# EAGLE design particle-logo-v1 (EAGLE 7.5.0)
DATABASE: /home/monkbroc/Electronics/eagle/PARTSDB.tsv
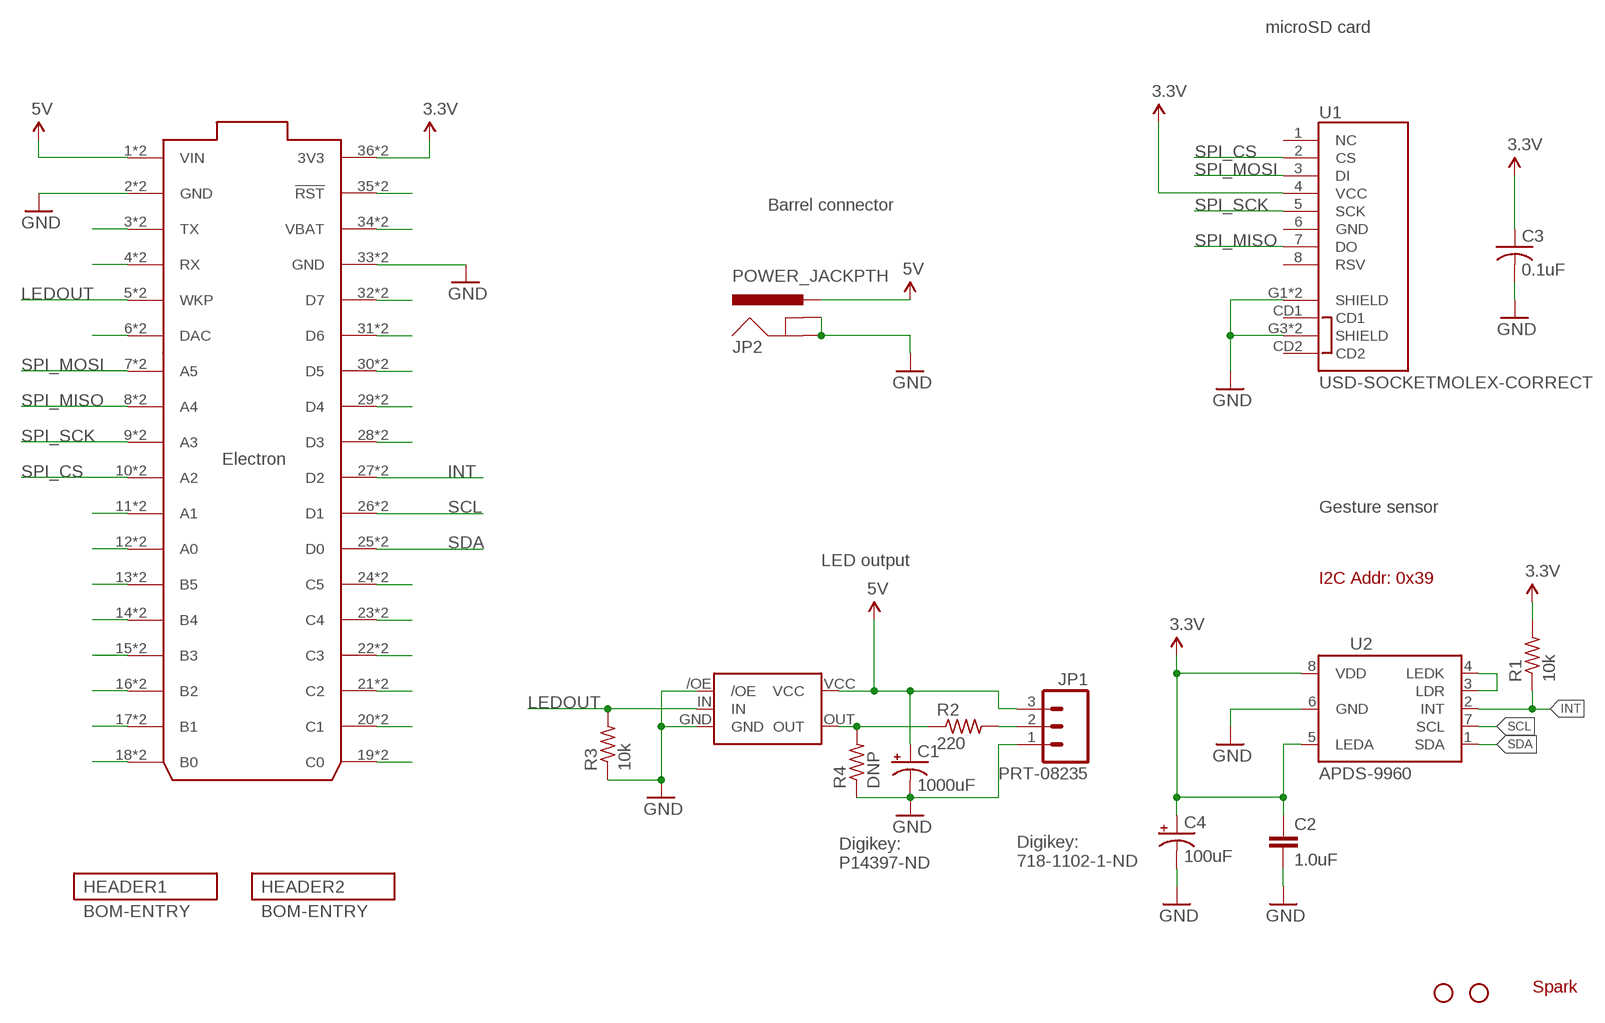
[diagram p0: schematic, sheet 1]
HEADER1 (BOM-ENTRY): PARTNO: PPTC181LFBN-RC
HEADER2 (BOM-ENTRY): PARTNO: PPTC181LFBN-RC

## Parts
C1  1000uF  CAP_POL8MMX20MM-FLAT-MIR  [CPOL-8MMX20MM-FLAT-MIR]
C2  1.0uF  1.0UF-16V-10%(0603)  [0603-CAP]
C3  0.1uF  C-USC0603  [C0603]
C4  100uF  100UF-10V-10%(TANT)  [EIA7343]
JP1  PRT-08235  M03SCREW  [SCREWTERMINAL-3.5MM-3]
JP2  POWER_JACKPTH  [POWER_JACK_PTH]
R1  10k  R-US_R0603  [R0603]
R2  220  R-US_R0603  [R0603]
R3  10k  R-US_R0603  [R0603]
R4  DNP  R-US_R0603  [R0603]
STANDOFF1  STAND-OFFSCREW-2  [STAND-OFF-2]
STANDOFF2  STAND-OFFSCREW-2  [STAND-OFF-2]
U1  USD-SOCKETMOLEX-CORRECT  [MICRO-SD-MOLEX-CORRECT]
U2  APDS-9960  [APDS-9960]
U3  ELECTRON_WITH_EXTERNAL_HEADERS_NT  [ELECTRON_EXTERNAL_NT]
U4  NL17SZ125SOT553  [SOT-553]
U$1  SPARK_LOGO2  [SPARK_LOGO2]

## Nets
3.3V: C2.1 C3.1 C4.A(+) R1.2 U1.4(VCC) U2.5(LEDA) U2.8(VDD) U3.36(3V3) U3.@36(3V3)
5V: C1.2(+) JP1.3 JP2.PWR U3.1(VIN) U3.@1(VIN) U4.VCC
GND: C1.1(-) C2.2 C3.2 C4.C(-) JP1.1 JP2.GND JP2.GNDBREAK R3.1 R4.1 U1.G1(SHIELD) U1.G2(SHIELD) U1.G3(SHIELD) U1.G4(SHIELD) U2.6(GND) U3.2(GND) U3.33(GND) U3.@2(GND) U3.@33(GND) U4./OE U4.GND
INT: R1.1 U2.2(INT) U3.27(D2) U3.@27(D2)
LEDOUT: R3.2 U3.5(WKP) U3.@5(WKP) U4.IN
N$1: R2.1 R4.2 U4.OUT
N$2: U2.3(LDR) U2.4(LEDK)
N$3: JP1.2 R2.2
N$4: U3.3(TX) U3.@3(TX)
N$5: U3.4(RX) U3.@4(RX)
N$7: U3.6(DAC) U3.@6(DAC)
N$8: U3.11(A1) U3.@11(A1)
N$9: U3.12(A0) U3.@12(A0)
N$10: U3.13(B5) U3.@13(B5)
N$11: U3.14(B4) U3.@14(B4)
N$12: U3.15(B3) U3.@15(B3)
N$13: U3.16(B2) U3.@16(B2)
N$14: U3.17(B1) U3.@17(B1)
N$15: U3.18(B0) U3.@18(B0)
N$16: U3.19(C0) U3.@19(C0)
N$17: U3.20(C1) U3.@20(C1)
N$18: U3.21(C2) U3.@21(C2)
N$19: U3.22(C3) U3.@22(C3)
N$20: U3.23(C4) U3.@23(C4)
N$21: U3.24(C5) U3.@24(C5)
N$22: U3.28(D3) U3.@28(D3)
N$24: U3.29(D4) U3.@29(D4)
N$25: U3.30(D5) U3.@30(D5)
N$26: U3.31(D6) U3.@31(D6)
N$27: U3.32(D7) U3.@32(D7)
N$29: U3.34(VBAT) U3.@34(VBAT)
N$30: U3.35(!RST) U3.@35(!RST)
SCL: U2.7(SCL) U3.26(D1) U3.@26(D1)
SDA: U2.1(SDA) U3.25(D0) U3.@25(D0)
SPI_CS: U1.2(CS) U3.10(A2) U3.@10(A2)
SPI_MISO: U1.7(DO) U3.8(A4) U3.@8(A4)
SPI_MOSI: U1.3(DI) U3.7(A5) U3.@7(A5)
SPI_SCK: U1.5(SCK) U3.9(A3) U3.@9(A3)
Unconnected: U1.1(NC) U1.6(GND) U1.8(RSV) U1.CD1 U1.CD2

## Notes on the sheet
- microSD card
- Barrel connector
- Gesture sensor
- LED output
- I2C Addr: 0x39
- Digikey:
  P14397-ND
- Digikey: 
  718-1102-1-ND

## Library data of the parts
C1 = MuniRent:CAP_POL: Capacitor Polarized These are standard SMD and PTH capacitors. Normally 10uF, 47uF, and 100uF in electrolytic and tantalum varieties. Always verify the external diameter of the through hole cap, it varies with capacity, voltage, and manufacturer. The EIA devices should be standard.; PARTNO: EEU-FR1C102L
C2 = SparkFun-Capacitors:1.0UF-16V-10%(0603): CAP-00868; PARTNO: 0603YD105KAT2A; PROD_ID: CAP-00868
C3 = rcl:C-US: CAPACITOR, American symbol; PARTNO: CC0603JRX7R7BB104
C4 = SparkFun-Capacitors:100UF-10V-10%(TANT): CAP-07890; PARTNO: TAJD107K020RNJ; PROD_ID: CAP-07890
JP1 = SparkFun-Connectors:M03: Header 3 Standard 3-pin 0.1" header. Use with straight break away headers (SKU : PRT-00116), right angle break away headers (PRT-00553), swiss pins (PRT-00743), machine pins (PRT-00117), and female headers (PRT-00115). Molex polarized connector foot print use with SKU : PRT-08232 with associated crimp pins and housings.; PROD_ID: CONN-08288
JP2 = SparkFun-Connectors:POWER_JACK: Power Jack This is the standard 5.5mm barrel jack for power. The PTH is the most common, proven, reliable, footprint. The Slot footprint only works if the mill layer is transmitted to the PCB fab house so be warned. Mating wall wart : TOL-00298 (and others); PROD_ID: CONN-08197
R1 R3 = rcl:R-US_: RESISTOR, American symbol; PARTNO: ERJ-3EKF1002V
R2 = rcl:R-US_: RESISTOR, American symbol; PARTNO: ERJ-3GEYJ221V
R4 = rcl:R-US_: RESISTOR, American symbol; DNP: t
STANDOFF1 STANDOFF2 = SparkFun-Electromechanical:STAND-OFF: #4 Stand Off This is the mechanical footprint for a #4 phillips button head screw. Use the keepout ring to avoid running the screw head into surrounding components. SKU : PRT-00447; BOM: exclude
U1 = MuniRent:USD-SOCKET: microSD Socket Push-push type uSD socket. Schematic element and footprint production proven. Spark Fun Electronics SKU : PRT-00127. tDoc lines correctly indicate media card edge positions when inserting (unlocked, locked, depressed). NOTE: CD1 and CD2 are connected internally; PARTNO: 1040310811
U2 = SparkFun-Sensors:APDS-9960: Avago APDS-9960 digital proximity, ambient light, RGB, and gesture sensor.; PARTNO: APDS-9960; PROD_ID: SEN-12005
U3 = MuniRent:ELECTRON
U4 = Spark:NL17SZ125; PARTNO: NL17SZ125DTT1G
U$1 = Spark:SPARK_LOGO2; BOM: exclude

## Board
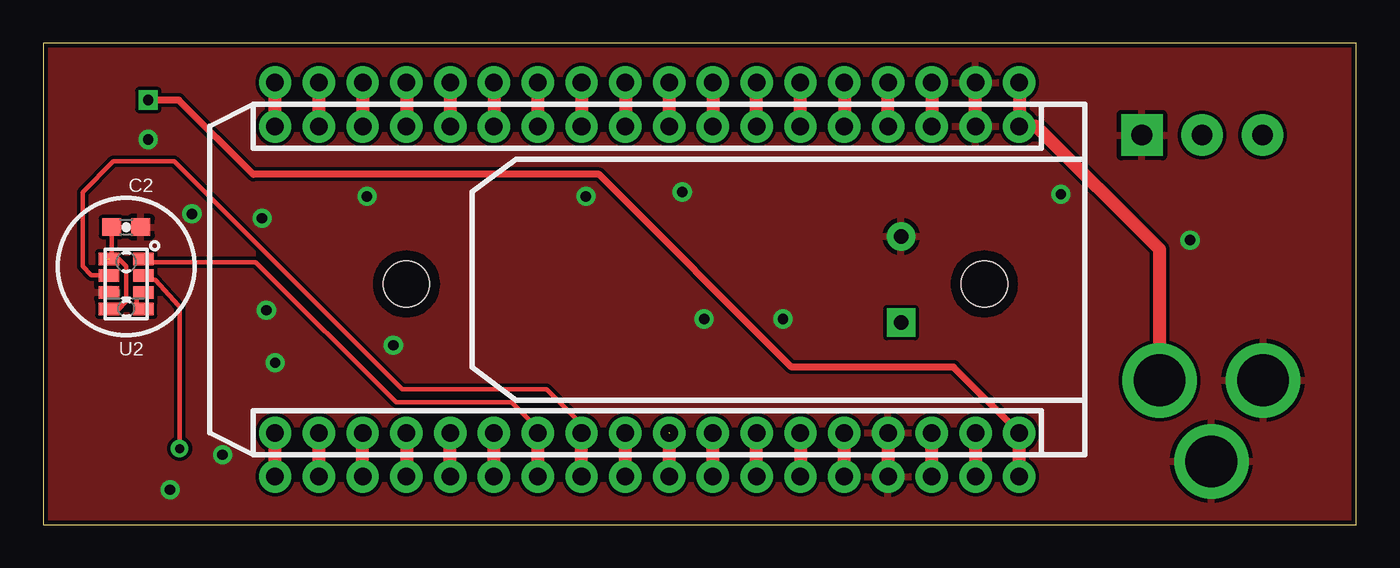
[diagram p1: board, top side]
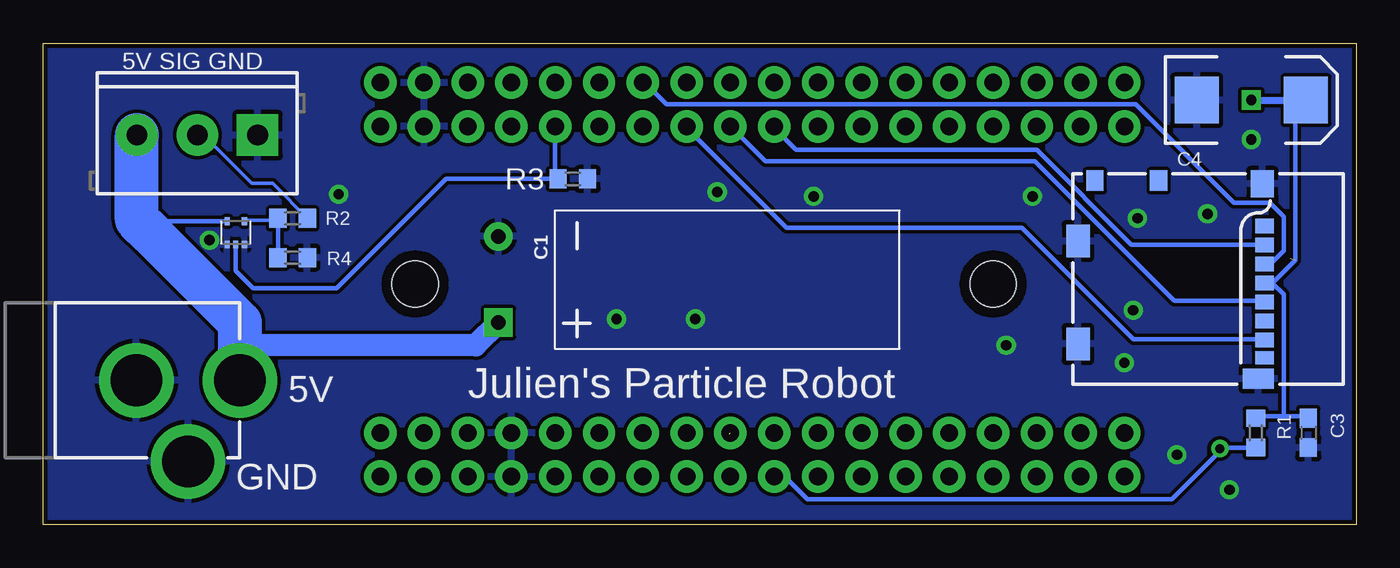
[diagram p2: board, bottom side, seen from below]

Size 76.2 x 27.94 mm. Coordinates in mm from the lower left corner, seen from the top.
Outline: 0,0 76.2,0 76.2,27.94 0,27.94 0,0
Copper layers (1*16): Top 0.035mm / dielectric 1.5mm / Bottom 0.035mm
Design rules "SparkFun": minimum track width 8mil, minimum drill 20mil, track to track 8mil, track to pad 8mil, pad to pad 8mil, via to via 8mil, smd to smd 8mil, copper to edge 10mil, drill to drill 8mil, minimum pad ring 12mil, minimum via ring 10mil, stop-mask expansion 4mil, vias tented up to drill 25mil, thermal gap 10mil

### Footprints (pad centres in the part's own frame; a part is rotated, then mirrored left to right if it is on the bottom)
CPOL-8MMX20MM-FLAT-MIR = drill 0.838 pad 1.651: 1 2.5,0 | drill 0.838 pad 1.651 square: 2 -2.5,0
0603-CAP = smd 1.1 x 1: 1 -0.85,0; 2 0.85,0
C0603 = smd 1.1 x 1: 1 -0.85,0; 2 0.85,0
EIA7343 = smd 2.55 x 2.7: A 3.17,0; C -3.17,0
SCREWTERMINAL-3.5MM-3 = drill 1.2 pad 2.413 square: 1 0,0 | drill 1.2 pad 2.413: 2 3.5,0; 3 7,0
POWER_JACK_PTH = drill 2.997 pad 4.318: GND 0,7.7; GNDBREAK 4.7,10.7; PWR 0,13.7
R0603 = smd 1 x 1.1: 1 -0.85,0; 2 0.85,0
STAND-OFF-2 = hole 2.667: 0,0
MICRO-SD-MOLEX-CORRECT = smd 0.85 x 1.1: 1 3.105,0.25; 2 2.005,0.25; 3 0.905,0.25; 4 -0.195,0.25; 5 -1.295,0.25; 6 -2.395,0.25; 7 -3.495,0.25 | smd 0.75 x 1.1: 8 -4.545,0.25 | smd 1.2 x 1: CD1 5.74,6.4; CD2 5.74,10.1 | smd 1.55 x 1.35: G1 5.565,0.375 | smd 1.17 x 1.8: G2 -5.755,0.6 | smd 1.9 x 1.35: G3 -3.735,11.075; G4 2.235,11.075
APDS-9960 = smd 1.2 x 0.72: 1 1,1.455; 2 1,0.485; 3 1,-0.485; 4 1,-1.455; 5 -1,-1.455; 6 -1,-0.485; 7 -1,0.485; 8 -1,1.455
ELECTRON_EXTERNAL_NT = drill 1.016 pad 1.88: 1 1.27,46.99; 2 1.27,44.45; 3 1.27,41.91; 4 1.27,39.37; 5 1.27,36.83; 6 1.27,34.29; 7 1.27,31.75; 8 1.27,29.21; 9 1.27,26.67; 10 1.27,24.13; 11 1.27,21.59; 12 1.27,19.05; 13 1.27,16.51; 14 1.27,13.97; 15 1.27,11.43; 16 1.27,8.89; 17 1.27,6.35; 18 1.27,3.81; 19 19.05,3.81; 20 19.05,6.35; 21 19.05,8.89; 22 19.05,11.43; 23 19.05,13.97; 24 19.05,16.51; 25 19.05,19.05; 26 19.05,21.59; 27 19.05,24.13; 28 19.05,26.67; 29 19.05,29.21; 30 19.05,31.75; 31 19.05,34.29; 32 19.05,36.83; 33 19.05,39.37; 34 19.05,41.91; 35 19.05,44.45; 36 19.05,46.99; @1 -1.27,46.99; @2 -1.27,44.45; @3 -1.27,41.91; @4 -1.27,39.37; @5 -1.27,36.83; @6 -1.27,34.29; @7 -1.27,31.75; @8 -1.27,29.21; @9 -1.27,26.67; @10 -1.27,24.13; @11 -1.27,21.59; @12 -1.27,19.05; @13 -1.27,16.51; @14 -1.27,13.97; @15 -1.27,11.43; @16 -1.27,8.89; @17 -1.27,6.35; @18 -1.27,3.81; @19 21.59,3.81; @20 21.59,6.35; @21 21.59,8.89; @22 21.59,11.43; @23 21.59,13.97; @24 21.59,16.51; @25 21.59,19.05; @26 21.59,21.59; @27 21.59,24.13; @28 21.59,26.67; @29 21.59,29.21; @30 21.59,31.75; @31 21.59,34.29; @32 21.59,36.83; @33 21.59,39.37; @34 21.59,41.91; @35 21.59,44.45; @36 21.59,46.99
SOT-553 = smd 0.3 x 0.45: /OE -0.5,0; GND 0.5,0; IN 0,0; OUT 0.5,1.35; VCC -0.5,1.35

### Placement (x,y rotation side)
C1  49.78,14.22 90 bottom
C2  4.83,17.27 0 top
C3  2.79,5.33 270 bottom
C4  6.1,24.64 0 bottom
JP1  63.75,22.61 180 bottom
JP2  78.49,8.38 270 bottom
R1  5.84,5.33 90 bottom
R2  61.72,17.78 0 bottom
R3  45.47,20.07 180 bottom
R4  61.72,15.49 180 bottom
STANDOFF1  54.61,13.97 0 bottom
STANDOFF2  21.08,13.97 0 bottom
U1  5.08,14.22 90 bottom
U2  4.83,13.97 0 top
U3  9.65,24.38 270 top
U4  65.02,16.26 0 bottom
U$1  55.37,7.11 0 bottom

### Tracks (layer width: path | path; a pad name or v marks a point on that pad's centre or on a via)
3.3V  (via drill 0.6)  (1 unrouted)
  Top 0.203: 4.01,12.65 U2.5 | 4.2,12.45 U2.5 | 4.06,17.27 C2.1 | 3.66,12.6 U2.5 | 6.1,24.59 v6.1,24.64
  Top 0.254: C2.1 3.98,15.57 U2.8 4.39,15.43 4.83,14.99 4.83,12.95 4.39,12.52 U2.5
  Top 0.406: U3.36 52.83,9.14 43.43,9.14 32.26,20.32 12.19,20.32 7.87,24.64 v6.1,24.64
  Top 0.762: U3.@36 U3.36
  Bottom 0.203: 2.85,6.3 C3.1 | 5.69,6.3 R1.2 | 3.56,24.59 C4.A | 4.88,14.02 5.28,14.02 U1.4 4.88,14.02
  Bottom 0.254: 5.69,6.3 4.22,6.3 | 4.22,6.3 2.85,6.3 | 4.22,6.3 4.22,13.36 4.88,14.02 3.56,15.34 3.56,24.59
  Bottom 0.406: v6.1,24.64 C4.A
5V
  Top 0.762: U3.@1 U3.1 57.64,23.11 64.79,15.97 JP2.PWR
  Bottom 0.203: 69.09,17.61 69.09,17.68 69.91,16.86
  Bottom 0.254: U4.VCC 69.09,17.61 70.58,17.61 | 64.77,11.43 64.77,11.72
  Bottom 1.27: C1.2 51.09,10.41 64.77,10.41 64.77,11.72
  Bottom 2.54: JP2.PWR 64.77,8.4 64.77,10.41 64.77,11.43 | 64.77,11.72 69.91,16.86 70.75,17.71 JP1.3
GND  (via drill 0.6)
  Top 0.762: U3.33 U3.@33 | U3.2 U3.@2
  Bottom 0.203: 48.97,3.05 U3.@33
  other vias: 18.8,19.05 37.08,19.3 59.05,19.18 38.35,11.94 10.41,4.06 8.64,18.03 66.55,16.51 31.5,19.05 42.93,11.94 12.95,12.45 7.37,2.03 13.46,9.4 12.7,17.78 20.32,10.41 6.1,22.35
  pour Bottom (rank 3): 0,27.94 76.2,27.94 76.2,0 0,0
  pour Top (rank 3): 76.2,27.94 0,27.94 0,0 76.2,0
INT  (via drill 0.51)
  Top 0.203: 5.84,14.28 5.64,14.28 U2.2 5.89,14.22
  Top 0.254: 5.89,14.22 6.5,14.22 7.87,12.7 7.92,12.65 v7.92,4.42
  Top 0.762: U3.@27 U3.27
  Bottom 0.203: 7.92,4.47 v7.92,4.42
  Bottom 0.254: U3.@27 33.68,2.69 33.07,2.69 31.85,1.47 10.72,1.47 7.92,4.27 v7.92,4.42 | 7.92,4.47 5.86,4.47 R1.1
LEDOUT
  Top 0.762: U3.@5 U3.5
  Bottom 0.254: U4.IN 65.02,14.73 64.01,13.72 59.18,13.72 52.83,20.07 R3.2 46.48,20.23 U3.5
N$1
  Bottom 0.203: U4.OUT 64.41,17.68 62.38,17.68 R2.1
  Bottom 0.254: R4.2 R2.1
N$2
  Top 0.203: 5.44,12.65 U2.4 | 5.44,13.46 U2.3
  Top 0.254: 5.44,13.46 5.44,12.65
N$3
  Bottom 0.203: R2.2 60.76,17.68 62.89,19.81 64.11,19.81 67.06,22.76 JP1.2
N$4
  Top 0.762: U3.@3 U3.3
N$5
  Top 0.762: U3.4 U3.@4
N$7
  Top 0.762: U3.6 U3.@6
N$8
  Top 0.762: U3.@11 U3.11
N$9
  Top 0.762: U3.@12 U3.12
N$10
  Top 0.762: U3.@13 U3.13
N$11
  Top 0.762: U3.@14 U3.14
N$12
  Top 0.762: U3.@15 U3.15
N$13
  Top 0.762: U3.@16 U3.16
N$14
  Top 0.762: U3.@17 U3.17
N$15
  Top 0.762: U3.18 U3.@18
N$16
  Top 0.762: U3.@19 U3.19
N$17
  Top 0.762: U3.20 U3.@20
N$18
  Top 0.762: U3.@21 U3.21
N$19
  Top 0.762: U3.22 U3.@22
N$20
  Top 0.762: U3.@23 U3.23
N$21
  Top 0.762: U3.@24 U3.24
N$22  (1 unrouted)
  Top 0.254: 36.37,5.28 36.32,5.23
  Top 0.762: 36.32,5.23 U3.@28
N$24
  Top 0.762: U3.@29 U3.29
N$25
  Top 0.762: U3.@30 U3.30
N$26
  Top 0.762: U3.31 U3.@31
N$27
  Top 0.762: U3.@32 U3.32
N$29
  Top 0.762: U3.@34 U3.34
N$30
  Top 0.762: U3.35 U3.@35
SCL
  Top 0.203: 4.22,14.48 U2.7
  Top 0.254: 4.22,14.48 2.79,14.48 2.29,14.99 2.29,19.3 4.06,21.08 7.62,21.08 20.83,7.87 29.21,7.87 31.24,5.84 U3.26
  Top 0.762: U3.@26 U3.26
SDA
  Top 0.203: 5.64,15.29 U2.1 5.89,15.24 | 28.4,5.54 U3.25 28.45,5.49
  Top 0.254: 5.89,15.24 12.34,15.24 20.47,7.11 27.18,7.11 28.7,5.59 U3.25
  Top 0.762: U3.25 U3.@25
SPI_CS
  Top 0.762: U3.@10 U3.10
  Bottom 0.203: 5.49,16.26 U1.2 | 33.73,22.96 U3.10
  Bottom 0.254: 5.49,16.26 13.06,16.26 18.54,21.74 32.51,21.74 33.73,22.96
SPI_MISO
  Top 0.762: U3.@8 U3.8
  Bottom 0.203: 5.49,10.77 U1.7
  Bottom 0.254: 5.49,10.77 12.95,10.77 19.41,17.22 33.07,17.22 38.81,22.96 U3.8
SPI_MOSI
  Top 0.762: U3.7 U3.@7
  Bottom 0.203: 4.88,15.24 5.28,15.24 U1.3
  Bottom 0.254: 4.88,15.24 4.22,15.9 4.22,17.88 5.03,18.69 7.11,18.69 12.8,24.38 40.03,24.38 41.25,25.6 U3.@7
SPI_SCK
  Top 0.762: U3.@9 U3.9
  Bottom 0.203: 5.49,13.01 U1.5
  Bottom 0.254: 5.49,13.01 10.57,13.01 18.64,21.08 34.29,21.08 U3.9

### Text on the board
bPlace: 5V SIG GND | Julien's Particle Robot | 5V | GND